# EasyEDA Pro project proprj_esp_s3_crokpocket_2025-06-12.epro, schematic Schematic1
Board Name: Board1; Create Date: 2025-04-29; Page Name: P1; Project Name: ESP_S3_CrokPocket; Schematic Name: Schematic1; Update Date: 2025-05-17; Company: Megazoid; Page Size: A4; Version: v1.7
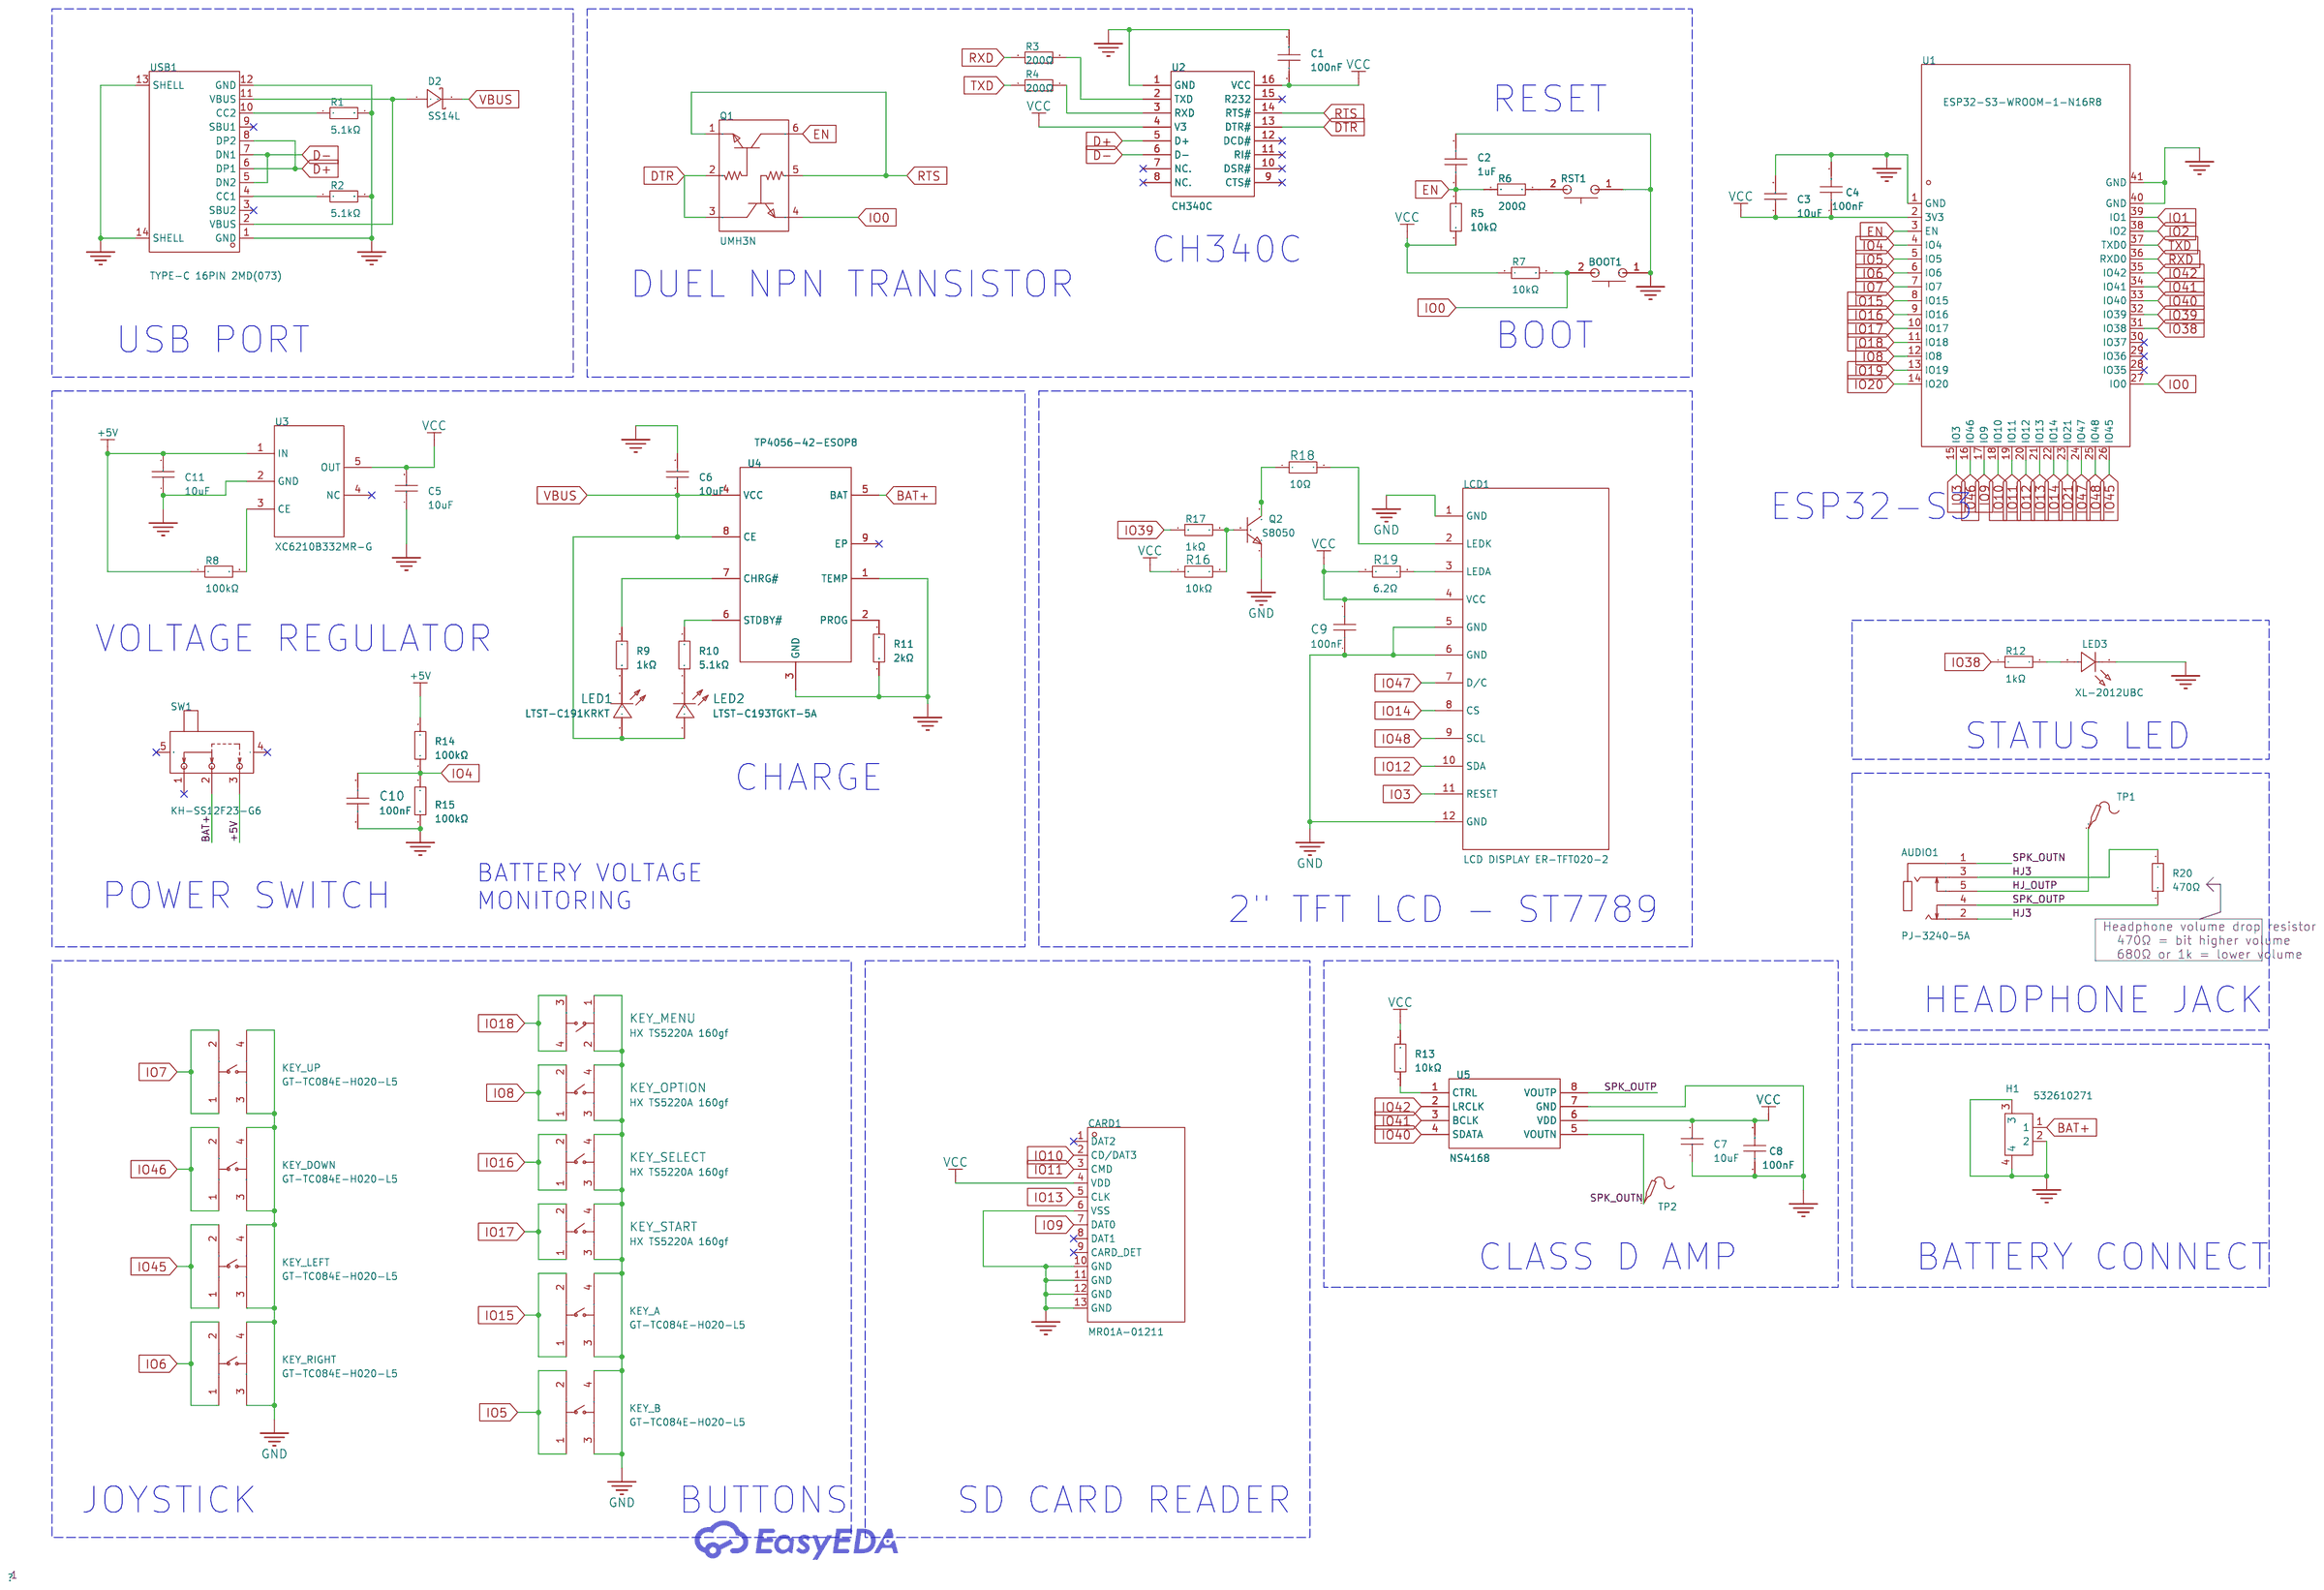
[diagram p0: schematic sheet]

## Parts
AUDIO1  PJ-3240-5A  [AUDIO-TH_PJ-3240-5A]
BOOT1  GT-TC029B-H025-L1N  [SW-SMD_L3.9-W3.0-P4.45]
C1  100nF  [C0603]
C2  1uF  [C0603]
C3  10uF  [C0805]
C4  100nF  [C0603]
C5  10uF  [C0805]
C6  10uF  [C0805]
C7  10uF  [C0805]
C8  100nF  [C0603]
C9  100nF  [C0603]
C10  100nF  [C0603]
C11  10uF  [C0805]
CARD1  MR01A-01211  [TF-SMD_MR01A-01211]
D2  SS14L  [SOD-123F_L2.8-W1.8-LS3.7-RD]
H1  532610271  [CONN-SMD_532610271]
KEY_A  GT-TC084E-H020-L5  [SW-SMD_4P-L5.2-W5.2-P3.70-LS6.4]
KEY_B  GT-TC084E-H020-L5  [SW-SMD_4P-L5.2-W5.2-P3.70-LS6.4]
KEY_DOWN  GT-TC084E-H020-L5  [SW-SMD_4P-L5.2-W5.2-P3.70-LS6.4]
KEY_LEFT  GT-TC084E-H020-L5  [SW-SMD_4P-L5.2-W5.2-P3.70-LS6.4]
KEY_MENU  HX TS5220A 160gf  [SW-SMD_4P-L5.2-W5.2-P3.70-LS6.4]
KEY_OPTION  HX TS5220A 160gf  [SW-SMD_4P-L5.2-W5.2-P3.70-LS6.4]
KEY_RIGHT  GT-TC084E-H020-L5  [SW-SMD_4P-L5.2-W5.2-P3.70-LS6.4]
KEY_SELECT  HX TS5220A 160gf  [SW-SMD_4P-L5.2-W5.2-P3.70-LS6.4]
KEY_START  HX TS5220A 160gf  [SW-SMD_4P-L5.2-W5.2-P3.70-LS6.4]
KEY_UP  GT-TC084E-H020-L5  [SW-SMD_4P-L5.2-W5.2-P3.70-LS6.4]
LCD1  LCD DISPLAY ER-TFT020-2  [LCD DISPLAY ER-TFT020-2]
LED1  LTST-C191KRKT  [LED0603-RD]
LED2  LTST-C193TGKT-5A  [LED0603-RD]
LED3  XL-2012UBC  [LED0805-RD]
Q1  UMH3N  [SC-70-6_L2.2-W1.3-P0.65-LS2.1-BR]
Q2  S8050  [SOT-23-3_L2.9-W1.6-P1.90-LS2.8-BR]
R1  5.1kΩ  [R0603]
R2  5.1kΩ  [R0603]
R3  200Ω  [R0603]
R4  200Ω  [R0603]
R5  10kΩ  [R0603]
R6  200Ω  [R0603]
R7  10kΩ  [R0603]
R8  100kΩ  [R0603]
R9  1kΩ  [R0603]
R10  5.1kΩ  [R0603]
R11  2kΩ  [R0603]
R12  1kΩ  [R0603]
R13  10kΩ  [R0603]
R14  100kΩ  [R0603]
R15  100kΩ  [R0603]
R16  10kΩ  [R0603]
R17  1kΩ  [R0603]
R18  10Ω  [R0603]
R19  6.2Ω  [R0603]
R20  470Ω  [R0603]
RST1  GT-TC029B-H025-L1N  [SW-SMD_L3.9-W3.0-P4.45]
SW1  KH-SS12F23-G6  [SW-TH_KH-SS12F23-G6]
TP1  -  [Test-Point-0.5mm]
TP2  -  [Test-Point-0.5mm]
U1  ESP32-S3-WROOM-1-N16R8  [WIRELM-SMD_ESP32-S3-WROOM-1]
U2  CH340C  [SOP-16_L10.0-W3.9-P1.27-LS6.0-BL]
U3  XC6210B332MR-G  [SOT-23-5_L3.0-W1.7-P0.95-LS2.8-BR]
U4  TP4056-42-ESOP8  [ESOP-8_L4.9-W3.9-P1.27-LS6.0-BL-EP]
U5  NS4168  [ESOP-8_L4.9-W3.9-P1.27-LS6.0-BL-EP-1]
USB1  TYPE-C 16PIN 2MD(073)  [USB-C-SMD_TYPE-C-6PIN-2MD-073]

## Library data of the parts
AUDIO1 = PJ-3240-5A: Connector Type:3.5mm耳机座 Current Rating (Max):500mA Voltage Rating (Max):30V; LCSC Part Name: 3.5mm耳机座; Supplier Part: C145814; Manufacturer: 韩国韩荣; Supplier Footprint: 插件; JLCPCB Part Class: Extended Part; Datasheet: https://atta.szlcsc.com/upload/public/pdf/source/20191118/C145814_0E7E40B7B3DE1A0F75813900A7F92A68.pdf; Supplier: LCSC; Connector Type: 3.5mm耳机座; Current Rating (Max): 500mA; Voltage Rating (Max): 30V
BOOT1 RST1 = GT-TC029B-H025-L1N: 触点电流:50mA;额定电压(DC):12V;绝缘电阻:100MΩ;电路结构:单刀单掷;安装方式:立贴;带灯:无;作用力:250gf@±30gf;机械寿命:10万次;带支架:否;; LCSC Part Name: 3.9*2.9*2.5mm 立贴 轻触开关; Supplier Part: C843669; Manufacturer: G-Switch(品赞); Supplier Footprint: SMD; JLCPCB Part Class: Extended Part; Datasheet: https://atta.szlcsc.com/upload/public/pdf/source/20201014/C843665_B07D254A2E90B746498E934B945CCD5F.pdf; Supplier: LCSC; Contact Current: 50mA; Voltage Rating (DC): 12V; Insulation Resistance: 100MΩ; Circuit: 单刀单掷; Mounting Style: 立贴; Actuator Style: 圆形按钮; Actuator/Cap Color: 黑色; With Lamp: 无; Operating Force: 250gf@±30gf; Mechanical Life: 10万次; Operating Temperature: -30℃~+85℃; Pin Style: SMD接片; Switch Length: 3.9mm; Switch Width: 2.9mm; Switch Height: 2.5mm; Strike Gundam: 否
C1 C4 C8 = CC0603KRX7R9BB104: 容值:100nF;精度:±10%;额定电压:50V;材质(温度系数):X7R;; LCSC Part Name: 100nF ±10% 50V; Supplier Part: C14663; Manufacturer: YAGEO(国巨); Supplier Footprint: 0603; JLCPCB Part Class: Basic Part; Datasheet: https://atta.szlcsc.com/upload/public/pdf/source/20180910/C282072_33301C7F631E79921B82A8DAC6BCC5B3.pdf; Supplier: LCSC; Tolerance: ±10%; Voltage Rated: 50V; Temperature Coefficient: X7R
C2 = CL10B105KA8NNNC: Capacitance: Tolerance:±10% Tolerance:±10% Voltage Rated: Temperature Coefficient:; LCSC Part Name: 1uF ±10% 25V; Supplier Part: C29936; Manufacturer: SAMSUNG(三星); Supplier Footprint: 0603; JLCPCB Part Class: Extended Part; Datasheet: https://atta.szlcsc.com/upload/public/pdf/source/20160218/1457707763339.pdf; Supplier: LCSC; Tolerance: ±10%
C3 C5-C7 C11 = CL21B106KPQNNNE: Capacitance: Tolerance:±10% Tolerance:±10% Voltage Rated: Temperature Coefficient:; LCSC Part Name: 10uF ±10% 10V; Supplier Part: C32635; Manufacturer: SAMSUNG(三星); Supplier Footprint: 0805; JLCPCB Part Class: Extended Part; Datasheet: https://atta.szlcsc.com/upload/public/pdf/source/20160218/1457707763339.pdf; Supplier: LCSC; Tolerance: ±10%
C9 C10 = CC0603KRX7R9BB104: Capacitance: Tolerance:±10% Tolerance:±10% Voltage Rated: Temperature Coefficient:; LCSC Part Name: 100nF ±10% 50V; Supplier Part: C14663; Manufacturer: YAGEO(国巨); Supplier Footprint: 0603; JLCPCB Part Class: Basic Part; Datasheet: https://atta.szlcsc.com/upload/public/pdf/source/20180910/C282072_33301C7F631E79921B82A8DAC6BCC5B3.pdf; Supplier: LCSC; Tolerance: ±10%
CARD1 = MR01A-01211: 卡类型:MicroSD卡(TF卡);连接器类型:卡座;卡连接方式:自弹式;本体最大高度:1.85mm;工作温度范围:-25℃~+85℃;; Supplier Part: C479742; Manufacturer: ATOM(爱特姆); Supplier Footprint: SMD; JLCPCB Part Class: Extended Part; Datasheet: https://atta.szlcsc.com/upload/public/pdf/source/20200107/C479742_0284EDD146B0D8F7A9D47B481AEA01A2.pdf; Supplier: LCSC; Card Type: MicroSD卡(TF卡); Connector Type: 卡座; Card Connection Mode: 自弹式; Maximum Body Height: 1.85mm; Operating Temperature Range: -25℃~+85℃
D2 = SS14L: 直流反向耐压(Vr):40V;平均整流电流(Io):1A;正向压降(Vf):550mV 1A;; Supplier Part: C190475; Manufacturer: Hottech(合科泰); Supplier Footprint: SOD-123F; JLCPCB Part Class: Extended Part; Datasheet: https://atta.szlcsc.com/upload/public/pdf/source/20180420/C190475_B414FF979281B09C05D3FAC1A9A40A2C.pdf; Supplier: LCSC; Reverse Voltage (Vr): 40V; Average Rectified Current (Io): 1A; Forward Voltage (Vf@If): 550mV 1A
H1 = 532610271_C177225: Pins Structure:1x2P Pitch:1.25mm Mounting Style:Horizontal attachment Reference Series:PicoBlade(MX 1.25) Number of Pins:2P Number of Rows:1 Number of PINs Per Row:2 Row Spacing:- Current Rating (Max):1A Contact Material:Phosphor Bronze Contact Plating:Ti; LCSC Part Name: 1x2P 间距:1.25mm 卧贴 系列:PicoBlade(MX 1.25); Supplier Part: C177225; Manufacturer: MOLEX; Supplier Footprint: SMD,P=1.25mm; JLCPCB Part Class: Extended Part; Supplier: LCSC; Pins Structure: 1x2P; Pitch: 1.25mm; Mounting Style: Horizontal attachment; Reference Series: PicoBlade(MX 1.25); Number of Pins: 2P; Number of Rows: 1; Number of PINs Per Row: 2; Current Rating (Max): 1A; Contact Material: Phosphor Bronze; Contact Plating: Tin; Operating Temperature Range: -40℃~+105℃; Rated Voltage (Max): 125V; Plastic Material: 玻纤增强PA; Flame Retardant Rating: UL94V-0; Supplementary Features: Auxiliary soldering legs; Colour: White; Z-Height of the Board: 3.4mm; X-Length of Bottom Edge on Board (Spacing Line): 7.65mm; Y-Width of Bottom Edge on Board: 5.2mm
KEY_A KEY_B KEY_DOWN KEY_LEFT KEY_RIGHT KEY_UP = GT-TC084E-H020-L5: Circuit:SPST Actuator Style:Round Button Operating Force:130gf Mounting Style:Brick nogging Switch Length:5.2mm Switch Width:5.2mm Switch Height:2mm Strike Gundam:不带 Contact Current:50mA Voltage Rating (DC):12V Insulation Resistance:100MΩ Actuator/Cap Col; LCSC Part Name: 5.2*5.2*2mm 立贴 轻触开关; Supplier Part: C2837076; Manufacturer: G-Switch(品赞); Supplier Footprint: SMD; JLCPCB Part Class: Extended Part; Datasheet: https://atta.szlcsc.com/upload/public/pdf/source/20210607/C2837076_6259009659A7F8AED300D8030EFA8B17.pdf; Supplier: LCSC; Circuit: SPST; Actuator Style: Round Button; Operating Force: 130gf; Mounting Style: Brick nogging; Switch Length: 5.2mm; Switch Width: 5.2mm; Switch Height: 2mm; Strike Gundam: 不带; Contact Current: 50mA; Voltage Rating (DC): 12V; Insulation Resistance: 100MΩ; Actuator/Cap Color: 金色; With Lamp: No; Pin Style: Gull Wing; Mechanical Life: 50万次; Operating Temperature: -30℃~+85℃
KEY_MENU KEY_OPTION KEY_SELECT KEY_START = HX TS5220A 160gf: Circuit:SPST Actuator Style:Round Button Operating Force:160gf Mounting Style:Brick nogging Switch Length:5.2mm Switch Width:5.2mm Switch Height:2mm Strike Gundam:- Contact Current:50mA Voltage Rating (AC):- Voltage Rating (DC):12V Power Rating:- Insulati; LCSC Part Name: 轻触开关贴片 5.2x5.2x2.0mm 铜头按键开关 160gf 立式开关; Supplier Part: C5340185; Manufacturer: hanxia(韩下); Supplier Footprint: SMD; JLCPCB Part Class: Extended Part; Datasheet: https://atta.szlcsc.com/upload/public/pdf/source/20221227/25A60DA11CC8B8803467471F4E33DC0A.pdf; Supplier: LCSC; Circuit: SPST; Actuator Style: Round Button; Operating Force: 160gf; Mounting Style: Brick nogging; Switch Length: 5.2mm; Switch Width: 5.2mm; Switch Height: 2mm; Contact Current: 50mA; Voltage Rating (DC): 12V; Insulation Resistance: 100MΩ; Actuator/Cap Color: 金色; With Lamp: No; Mechanical Life: 10万次; Operating Temperature: -25℃~+70℃
LCD1 = LCD DISPLAY ER-TFT020-2: Manufacturer: EastRising; Manufacturer Part: ER-TFT020-2; Supplier Part: ER-TFT020-2
LED1 = LTST-C191KRKT: Emitted Color:Red Forward Voltage (VF):2V Forward Voltage (VF):2V Power Dissipation:75mW Forward Current:20mA Dominant Wavelength:631nm Dominant Wavelength:631nm Peak Wavelength:639nm Diode Configuration:- Lens Color:无色透明透镜 Color Temperature:- Color Tempe; LCSC Part Name: 红灯; Supplier Part: C125099; Manufacturer: LITEON(光宝); Supplier Footprint: 0603; JLCPCB Part Class: Extended Part; Datasheet: https://atta.szlcsc.com/upload/public/pdf/source/20180129/C125099_15171878294931315872.pdf; Supplier: LCSC; Emitted Color: Red; Forward Voltage (VF): 2V; Power Dissipation: 75mW; Forward Current: 20mA; Dominant Wavelength: 631nm; Peak Wavelength: 639nm; Lens Color: 无色透明透镜; Luminous Intensity: 54mcd; Viewing Angle: 130°; Operating Temperature: -55℃~+85℃
LED2 = LTST-C193TGKT-5A: Emitted Color:Emerald Forward Voltage (VF):2.8V Forward Voltage (VF):2.8V Power Dissipation:76mW Forward Current:5mA Dominant Wavelength:520nm~535nm Dominant Wavelength:520nm~535nm Peak Wavelength:525nm Diode Configuration:- Lens Color:无色透明透镜 Color Temper; Supplier Part: C12065; Manufacturer: LITEON(光宝); Supplier Footprint: 0603; JLCPCB Part Class: Extended Part; Datasheet: https://atta.szlcsc.com/upload/public/pdf/source/20140530/1457707085588.pdf; Supplier: LCSC; Emitted Color: Emerald; Forward Voltage (VF): 2.8V; Power Dissipation: 76mW; Forward Current: 5mA; Dominant Wavelength: 520nm~535nm; Peak Wavelength: 525nm; Lens Color: 无色透明透镜; Luminous Intensity: 154mcd; Viewing Angle: 130°; Operating Temperature: -20℃~+80℃
LED3 = XL-2012UBC: 发光颜色:蓝色;功率:80mW;正向电流:25mA;主波长:460nm~469nm;透镜颜色:无色透明透镜;色温:-;发光角度:120°;载带方式:正贴;工作温度:-30℃~+85℃;; Supplier Part: C965817; Manufacturer: XINGLIGHT(成兴光); Supplier Footprint: 0805; JLCPCB Part Class: 扩展库; Datasheet: https://atta.szlcsc.com/upload/public/pdf/source/20221102/8821B2493CB1F6730115C59312B9E8D0.pdf; Supplier: LCSC; Emitted Color: 蓝色; Power Dissipation: 80mW; Forward Current: 25mA; Dominant Wavelength: 460nm~469nm; Peak Wavelength: 475nm; Lens Color: 无色透明透镜; Viewing Angle: 120°; Mounting Sytle: 正贴; Operating Temperature: -30℃~+85℃
Q1 = UMH3N: 晶体管类型:2个NPN-预偏置;功率(Pd):150mW;集电极电流(Ic):100mA;集射极击穿电压(Vceo):50V;; LCSC Part Name: 2个NPN-预偏置 100mA 50V; Supplier Part: C62892; Manufacturer: CJ(江苏长电/长晶); Supplier Footprint: SC-70-6(SOT-363); JLCPCB Part Class: Extended Part; Datasheet: https://atta.szlcsc.com/upload/public/pdf/source/20151109/1457707575095.pdf; Supplier: LCSC; Transistor Type: 2个NPN-预偏置; Power Dissipation (Pd): 150mW; Collector Current (Ic): 100mA; Collector-Emitter Breakdown Voltage (Vceo): 50V
Q2 = S8050_C181158: Transistor Type: Collector Current (Ic): Collector-Emitter Breakdown Voltage (Vceo): Power Dissipation (Pd): Transition Frequency (fT):150MHz Collector Cut-Off Current (Icbo):100nA Collector-Emitter Saturation Voltage (VCE(sat)@Ic,Ib):600mV@500mA,50mA Ope; LCSC Part Name: NPN 电流:500mA 耐压:25V H档; Supplier Part: C181158; Manufacturer: Hottech(合科泰); Supplier Footprint: SOT-23; JLCPCB Part Class: Extended Part; Datasheet: https://atta.szlcsc.com/upload/public/pdf/source/20220506/D987F39D56F2975D34EC7947E75C4ABC.pdf; Supplier: LCSC; Transition Frequency (fT): 150MHz; Collector Cut-Off Current (Icbo): 100nA; Collector-Emitter Saturation Voltage (VCE(sat)@Ic,Ib): 600mV@500mA,50mA
R1 R2 = 0603WAF5101T5E: 电阻类型:厚膜电阻;阻值:5.1kΩ;精度:±1%;功率:100mW;最大工作电压:75V;温度系数:±100ppm/℃;; LCSC Part Name: 5.1kΩ ±1% 100mW 厚膜电阻; Supplier Part: C23186; Manufacturer: UNI-ROYAL(厚声); Supplier Footprint: 0603; JLCPCB Part Class: Basic Part; Datasheet: https://atta.szlcsc.com/upload/public/pdf/source/20200306/C422600_1E6D84923E4A46A82E41ADD87F860B5C.pdf; Supplier: LCSC; Type: 厚膜电阻; Tolerance: ±1%; Power(Watts): 100mW; Overload Voltage (Max): 75V; Temperature Coefficient: ±100ppm/℃; Operating Temperature Range: -55℃~+155℃
R3 R4 R6 = 0603WAF2000T5E: 电阻类型:厚膜电阻;阻值:200Ω;精度:±1%;功率:100mW;最大工作电压:75V;温度系数:±100ppm/℃;; LCSC Part Name: 200Ω ±1% 100mW 厚膜电阻; Supplier Part: C8218; Manufacturer: UNI-ROYAL(厚声); Supplier Footprint: 0603; JLCPCB Part Class: 基础库; Datasheet: https://atta.szlcsc.com/upload/public/pdf/source/20200306/C422600_1E6D84923E4A46A82E41ADD87F860B5C.pdf; Supplier: LCSC; Type: 厚膜电阻; Tolerance: ±1%; Power(Watts): 100mW; Overload Voltage (Max): 75V; Temperature Coefficient: ±100ppm/℃; Operating Temperature Range: -55℃~+155℃
R5 R7 R13 = 0603WAF1002T5E: 电阻类型:厚膜电阻;阻值:10kΩ;精度:±1%;功率:100mW;最大工作电压:75V;温度系数:±100ppm/℃;; LCSC Part Name: 厚膜电阻 10kΩ ±1% 100mW; Supplier Part: C25804; Manufacturer: UNI-ROYAL(厚声); Supplier Footprint: 0603; JLCPCB Part Class: 基础库; Datasheet: https://atta.szlcsc.com/upload/public/pdf/source/20200306/C422600_1E6D84923E4A46A82E41ADD87F860B5C.pdf; Supplier: LCSC; Type: 厚膜电阻; Tolerance: ±1%; Power(Watts): 100mW; Overload Voltage (Max): 75V; Temperature Coefficient: ±100ppm/℃; Operating Temperature Range: -55℃~+155℃
R8 R14 R15 = 0603WAF1003T5E: Type:Thick Film Resistors Resistance:100kΩ Tolerance:±1% Tolerance:±1% Power(Watts): Overload Voltage (Max): Temperature Coefficient:±100ppm/℃ Temperature Coefficient:±100ppm/℃ Operating Temperature Range:-55℃~+155℃ Operating Temperature Range:-55℃~+155℃; LCSC Part Name: 100kΩ ±1% 100mW 厚膜电阻; Supplier Part: C25803; Manufacturer: UNI-ROYAL(厚声); Supplier Footprint: 0603; JLCPCB Part Class: Basic Part; Datasheet: https://atta.szlcsc.com/upload/public/pdf/source/20200306/C422600_1E6D84923E4A46A82E41ADD87F860B5C.pdf; Supplier: LCSC; Type: Thick Film Resistors; Tolerance: ±1%; Temperature Coefficient: ±100ppm/℃; Operating Temperature Range: -55℃~+155℃
R9 R12 = 0603WAF1001T5E: 电阻类型:厚膜电阻;阻值:1kΩ;精度:±1%;功率:100mW;最大工作电压:75V;温度系数:±100ppm/℃;; LCSC Part Name: 1kΩ ±1% 100mW 厚膜电阻; Supplier Part: C21190; Manufacturer: UNI-ROYAL(厚声); Supplier Footprint: 0603; JLCPCB Part Class: 基础库; Datasheet: https://atta.szlcsc.com/upload/public/pdf/source/20200306/C422600_1E6D84923E4A46A82E41ADD87F860B5C.pdf; Supplier: LCSC; Type: 厚膜电阻; Tolerance: ±1%; Power(Watts): 100mW; Overload Voltage (Max): 75V; Temperature Coefficient: ±100ppm/℃; Operating Temperature Range: -55℃~+155℃
R10 = 0603WAF5101T5E: Type:Thick Film Resistors Resistance:5.1kΩ Tolerance:±1% Tolerance:±1% Power(Watts): Overload Voltage (Max): Temperature Coefficient:±100ppm/℃ Temperature Coefficient:±100ppm/℃ Operating Temperature Range:-55℃~+155℃ Operating Temperature Range:-55℃~+155℃; LCSC Part Name: 5.1kΩ ±1% 100mW 厚膜电阻; Supplier Part: C23186; Manufacturer: UNI-ROYAL(厚声); Supplier Footprint: 0603; JLCPCB Part Class: Basic Part; Datasheet: https://atta.szlcsc.com/upload/public/pdf/source/20200306/C422600_1E6D84923E4A46A82E41ADD87F860B5C.pdf; Supplier: LCSC; Type: Thick Film Resistors; Tolerance: ±1%; Temperature Coefficient: ±100ppm/℃; Operating Temperature Range: -55℃~+155℃
R11 = 0603WAF2001T5E: 电阻类型:厚膜电阻;阻值:2kΩ;精度:±1%;功率:100mW;最大工作电压:75V;温度系数:±100ppm/℃;; LCSC Part Name: 2kΩ ±1% 100mW 厚膜电阻; Supplier Part: C22975; Manufacturer: UNI-ROYAL(厚声); Supplier Footprint: 0603; JLCPCB Part Class: 基础库; Datasheet: https://atta.szlcsc.com/upload/public/pdf/source/20200306/C422600_1E6D84923E4A46A82E41ADD87F860B5C.pdf; Supplier: LCSC; Type: 厚膜电阻; Tolerance: ±1%; Power(Watts): 100mW; Overload Voltage (Max): 75V; Temperature Coefficient: ±100ppm/℃; Operating Temperature Range: -55℃~+155℃
R16 = 0603WAF1002T5E: Type:Thick Film Resistors Resistance:10kΩ Tolerance:±1% Tolerance:±1% Power(Watts): Overload Voltage (Max): Temperature Coefficient:±100ppm/℃ Temperature Coefficient:±100ppm/℃ Operating Temperature Range:-55℃~+155℃ Operating Temperature Range:-55℃~+155℃; LCSC Part Name: 厚膜电阻 10kΩ ±1% 100mW; Supplier Part: C25804; Manufacturer: UNI-ROYAL(厚声); Supplier Footprint: 0603; JLCPCB Part Class: Basic Part; Datasheet: https://atta.szlcsc.com/upload/public/pdf/source/20200306/C422600_1E6D84923E4A46A82E41ADD87F860B5C.pdf; Supplier: LCSC; Type: Thick Film Resistors; Tolerance: ±1%; Temperature Coefficient: ±100ppm/℃; Operating Temperature Range: -55℃~+155℃
R17 = 0603WAF1001T5E: Type:Thick Film Resistors Resistance:1kΩ Tolerance:±1% Tolerance:±1% Power(Watts): Overload Voltage (Max): Temperature Coefficient:±100ppm/℃ Temperature Coefficient:±100ppm/℃ Operating Temperature Range:-55℃~+155℃ Operating Temperature Range:-55℃~+155℃; LCSC Part Name: 1kΩ ±1% 100mW 厚膜电阻; Supplier Part: C21190; Manufacturer: UNI-ROYAL(厚声); Supplier Footprint: 0603; JLCPCB Part Class: Basic Part; Datasheet: https://atta.szlcsc.com/upload/public/pdf/source/20200306/C422600_1E6D84923E4A46A82E41ADD87F860B5C.pdf; Supplier: LCSC; Type: Thick Film Resistors; Tolerance: ±1%; Temperature Coefficient: ±100ppm/℃; Operating Temperature Range: -55℃~+155℃
R18 = 0603WAF100JT5E: Type:Thick Film Resistors Resistance:10Ω Tolerance:±1% Tolerance:±1% Power(Watts): Overload Voltage (Max): Temperature Coefficient:±400ppm/℃ Temperature Coefficient:±400ppm/℃ Operating Temperature Range:-55℃~+155℃ Operating Temperature Range:-55℃~+155℃; LCSC Part Name: 10Ω ±1% 100mW 厚膜电阻; Supplier Part: C22859; Manufacturer: UNI-ROYAL(厚声); Supplier Footprint: 0603; JLCPCB Part Class: Basic Part; Datasheet: https://atta.szlcsc.com/upload/public/pdf/source/20200306/C422600_1E6D84923E4A46A82E41ADD87F860B5C.pdf; Supplier: LCSC; Type: Thick Film Resistors; Tolerance: ±1%; Temperature Coefficient: ±400ppm/℃; Operating Temperature Range: -55℃~+155℃
R19 = 0603WAF620KT5E: Type:Thick Film Resistors Resistance:6.2Ω Tolerance:±1% Tolerance:±1% Power(Watts): Overload Voltage (Max): Temperature Coefficient:±200ppm/℃ Temperature Coefficient:±200ppm/℃ Operating Temperature Range:-55℃~+155℃ Operating Temperature Range:-55℃~+155℃; LCSC Part Name: 6.2Ω ±1% 100mW 厚膜电阻; Supplier Part: C23210; Manufacturer: UNI-ROYAL(厚声); Supplier Footprint: 0603; JLCPCB Part Class: Extended Part; Datasheet: https://atta.szlcsc.com/upload/public/pdf/source/20200306/C422600_1E6D84923E4A46A82E41ADD87F860B5C.pdf; Supplier: LCSC; Type: Thick Film Resistors; Tolerance: ±1%; Temperature Coefficient: ±200ppm/℃; Operating Temperature Range: -55℃~+155℃
R20 = 0603WAF4700T5E: Type:Thick Film Resistors Resistance: Tolerance:±1% Tolerance:±1% Power(Watts): Overload Voltage (Max): Temperature Coefficient:±100ppm/℃ Temperature Coefficient:±100ppm/℃ Operating Temperature Range:-55℃~+155℃ Operating Temperature Range:-55℃~+155℃; LCSC Part Name: 470Ω ±1% 100mW 厚膜电阻; Supplier Part: C23179; Manufacturer: UNI-ROYAL(厚声); Supplier Footprint: 0603; JLCPCB Part Class: Basic Part; Datasheet: https://atta.szlcsc.com/upload/public/pdf/source/20200306/C422600_1E6D84923E4A46A82E41ADD87F860B5C.pdf; Supplier: LCSC; Type: Thick Film Resistors; Tolerance: ±1%; Temperature Coefficient: ±100ppm/℃; Operating Temperature Range: -55℃~+155℃
SW1 = KH-SS12F23-G6: LCSC Part Name: 拨动开关 KH-SS12F23-G6; Supplier Part: C5274466; Manufacturer: kinghelm(金航标); Supplier Footprint: 插件; JLCPCB Part Class: Extended Part; Datasheet: https://atta.szlcsc.com/upload/public/pdf/source/20221118/BFF37B84B5CB1A55659AB56BFB65BEAA.pdf; Supplier: LCSC
TP1 TP2 = Test-Point: Test Point 测试点
U1 = ESP32-S3-WROOM-1-N16R8: Supplier Part: C2913202; Manufacturer: ESPRESSIF(乐鑫); Supplier Footprint: SMD,18x25.5mm; JLCPCB Part Class: Extended Part; Datasheet: https://atta.szlcsc.com/upload/public/pdf/source/20220705/4E799F39581577F766659887F738A439.pdf; Supplier: LCSC
U2 = CH340C: 应用功能:Transceiver;接口协议:USB 2.0;数据速率:2Mbps;供电电压:3.3V；5V;; Supplier Part: C84681; Manufacturer: WCH(南京沁恒); Supplier Footprint: SOP-16; JLCPCB Part Class: Extended Part; Datasheet: https://atta.szlcsc.com/upload/public/pdf/source/20200819/C84681_ADBED554CE321879DBD6B1D06488689C.pdf; Supplier: LCSC; Applications Function: Transceiver; Protocol: USB 2.0; Data Rate: 2Mbps; Supply Voltage: 3.3V；5V
U3 = XC6210B332MR-G: Output Type:Fixed Maximum Input Voltage:6V Output Voltage:3.3V Output Voltage:3.3V Output Current:700mA Power Supply Rejection Ratio (PSRR):60dB@(1kHz) Dropout Voltage:75mV@(100mA) standby current:55uA Feature:Low ESR；Overcurrent Protection(OCP)；With abil; LCSC Part Name: 输入6V 输出3.3V 700mA; Supplier Part: C47719; Manufacturer: TOREX(特瑞仕); Supplier Footprint: SOT-25-5; JLCPCB Part Class: Extended Part; Datasheet: https://atta.szlcsc.com/upload/public/pdf/source/20200117/C484291_06FA0404E400374A8BAFCC9C6533AE86.pdf; Supplier: LCSC; Output Type: Fixed; Maximum Input Voltage: 6V; Output Voltage: 3.3V; Output Current: 700mA; Power Supply Rejection Ratio (PSRR): 60dB@(1kHz); Dropout Voltage: 75mV@(100mA); standby current: 55uA; Feature: Low ESR；Overcurrent Protection(OCP)；With ability; Operating Temperature: -40℃~+85℃; Output Polarity: Positive electrode; Number of Outputs: 1
U4 = TP4056-42-ESOP8: Supplier Part: C16581; Manufacturer: TOPPOWER(南京拓微); Supplier Footprint: ESOP-8; JLCPCB Part Class: Extended Part; Datasheet: https://atta.szlcsc.com/upload/public/pdf/source/20190626/C16581_611BCF5D7CF554EAE465137A8F68DB3E.pdf; Supplier: LCSC
U5 = NS4168: NS4168 2.5W I2S数字输入单声道D类音频功率放大器功放芯片IC
USB1 = TYPE-C 16PIN 2MD(073): 连接器类型:Type-C;标准:-;公母:母座;触点数量:16;端口数量:1;安装方式:卧贴;额定电流 - 电源:5A;工作温度范围:-25℃~+85℃;; LCSC Part Name: TYPE-C母座 16P 4脚插件带定位柱 不锈钢外壳 2次模顶; Supplier Part: C2765186; Manufacturer: SHOU HAN(首韩); Supplier Footprint: SMD; JLCPCB Part Class: Extended Part; Datasheet: https://atta.szlcsc.com/upload/public/pdf/source/20211123/39B17C16241EAC15C5E277BDA434118E.pdf; Supplier: LCSC; Connector Type: Type-C; Gender: 母座; Number of Contacts: 16; Number of Ports: 1; Mounting Style: 卧贴; Current Rating - Power (Max): 5A; Operating Temperature Range: -25℃~+85℃

## Nets
+5V: C11.2 R8.1 R14.2 SW1.3 U3.1(IN)
GND: BOOT1.1 C1.2 C2.2 C3.2 C4.2 C5.1 C6.2 C7.1 C8.1 C9.1 C10.2 C11.1 CARD1.6(VSS) CARD1.10(GND) CARD1.11(GND) CARD1.12(GND) CARD1.13(GND) H1.2 H1.3 H1.4 KEY_A.3 KEY_A.4 KEY_B.3 KEY_B.4 KEY_DOWN.3 KEY_DOWN.4 KEY_LEFT.3 KEY_LEFT.4 KEY_MENU.1 KEY_MENU.2 KEY_OPTION.3 KEY_OPTION.4 KEY_RIGHT.3 KEY_RIGHT.4 KEY_SELECT.3 KEY_SELECT.4 KEY_START.3 KEY_START.4 KEY_UP.3 KEY_UP.4 LCD1.1(GND) LCD1.5(GND) LCD1.6(GND) LCD1.12(GND) LED3.1(K) Q2.2 R1.2 R2.2 R11.1 R15.2 RST1.1 U1.1(GND) U1.40(GND) U1.41(GND) U2.1(GND) U3.2(GND) U4.1(TEMP) U4.3(GND) U5.7(GND) USB1.1(GND) USB1.12(GND) USB1.13(SHELL) USB1.14(SHELL)
VBUS: C6.1 D2.1(K) LED1.2(+) LED2.2(A) U4.4(VCC) U4.8(CE)
VCC: C1.1 C3.1 C4.1 C5.2 C7.2 C8.2 C9.2 CARD1.4(VDD) LCD1.4(VCC) R5.2 R7.1 R13.2 R16.1 R19.1 U1.2(3V3) U2.4(V3) U2.16(VCC) U3.5(OUT) U5.6(VDD)
BAT+: H1.1 SW1.2 U4.5(BAT)
D+: U2.5(D+) USB1.6(DP1) USB1.8(DP2)
D-: U2.6(D-) USB1.5(DN2) USB1.7(DN1)
DTR: Q1.2(B) Q1.3(C) U2.13(DTR#)
EN: C2.1 Q1.6(C) R5.1 R6.2 U1.3(EN)
HJ3: AUDIO1.2 AUDIO1.3 R20.2
HJ_OUTP: AUDIO1.5 TP1.1
IO0: BOOT1.2 Q1.4(E) R7.2 U1.27(IO0)
IO1: U1.39(IO1)
IO2: U1.38(IO2)
IO3: LCD1.11(RESET) U1.15(IO3)
IO4: C10.1 R14.1 R15.1 U1.4(IO4)
IO5: KEY_B.1 KEY_B.2 U1.5(IO5)
IO6: KEY_RIGHT.1 KEY_RIGHT.2 U1.6(IO6)
IO7: KEY_UP.1 KEY_UP.2 U1.7(IO7)
IO8: KEY_OPTION.1 KEY_OPTION.2 U1.12(IO8)
IO9: CARD1.7(DAT0) U1.17(IO9)
IO10: CARD1.2(CD/DAT3) U1.18(IO10)
IO11: CARD1.3(CMD) U1.19(IO11)
IO12: LCD1.10(SDA) U1.20(IO12)
IO13: CARD1.5(CLK) U1.21(IO13)
IO14: LCD1.8(CS) U1.22(IO14)
IO15: KEY_A.1 KEY_A.2 U1.8(IO15)
IO16: KEY_SELECT.1 KEY_SELECT.2 U1.9(IO16)
IO17: KEY_START.1 KEY_START.2 U1.10(IO17)
IO18: KEY_MENU.3 KEY_MENU.4 U1.11(IO18)
IO19: U1.13(IO19)
IO20: U1.14(IO20)
IO21: U1.23(IO21)
IO38: R12.1 U1.31(IO38)
IO39: R17.1 U1.32(IO39)
IO40: U1.33(IO40) U5.4(SDATA)
IO41: U1.34(IO41) U5.3(BCLK)
IO42: U1.35(IO42) U5.2(LRCLK)
IO45: KEY_LEFT.1 KEY_LEFT.2 U1.26(IO45)
IO46: KEY_DOWN.1 KEY_DOWN.2 U1.16(IO46)
IO47: LCD1.7(D/C) U1.24(IO47)
IO48: LCD1.9(SCL) U1.25(IO48)
RTS: Q1.1(E) Q1.5(B) U2.14(RTS#)
RXD: R3.1 U1.36(RXD0)
SPK_OUTN: AUDIO1.1 TP2.1 U5.5(VOUTN)
SPK_OUTP: AUDIO1.4 R20.1 U5.8(VOUTP)
TXD: R4.1 U1.37(TXD0)
$1N2657: D2.2(A) USB1.2(VBUS) USB1.11(VBUS)
Net-(LCD1-2): LCD1.2(LEDK) R18.2
Net-(LCD1-3): LCD1.3(LEDA) R19.2
Net-(LED1-1): LED1.1(-) R9.1
Net-(LED2-1): LED2.1(K) R10.1
Net-(LED3-2): LED3.2(A) R12.2
Net-(Q2-1): Q2.1 R16.2 R17.2
Net-(Q2-3): Q2.3 R18.1
Net-(R1-1): R1.1 USB1.10(CC2)
Net-(R2-1): R2.1 USB1.4(CC1)
Net-(R3-2): R3.2 U2.2(TXD)
Net-(R4-2): R4.2 U2.3(RXD)
Net-(R6-1): R6.1 RST1.2
Net-(R8-2): R8.2 U3.3(CE)
Net-(R9-2): R9.2 U4.7(CHRG#)
Net-(R10-2): R10.2 U4.6(STDBY#)
Net-(R11-2): R11.2 U4.2(PROG)
Net-(R13-1): R13.1 U5.1(CTRL)

Not connected (* = marked no-connect by the designer): CARD1 1(DAT2)* 8(DAT1)* 9(CARD_DET)*; SW1 1* 4* 5*; U1 28(IO35)* 29(IO36)* 30(IO37)*; U2 7(NC.)* 8(NC.)* 9(CTS#)* 10(DSR#)* 11(RI#)* 12(DCD#)* 15(R232)*; U3 4(NC)*; U4 9(EP)*; USB1 3(SBU2)* 9(SBU1)*

## Notes on the sheet
- RESET
- CH340C
- DUEL NPN TRANSISTOR
- BOOT
- USB PORT
- ESP32-S3
- VOLTAGE REGULATOR
- STATUS LED
- CHARGE
- BATTERY VOLTAGE
- POWER SWITCH
- MONITORING
- 2" TFT LCD - ST7789
- Headphone volume drop resistor
- 470Ω = bit higher volume
- 680Ω or 1k = lower volume
- HEADPHONE JACK
- CLASS D AMP
- BATTERY CONNECT
- JOYSTICK
- BUTTONS
- SD CARD READER
